# EAGLE design adafruit tlc59711 v1 (EAGLE 6.3)
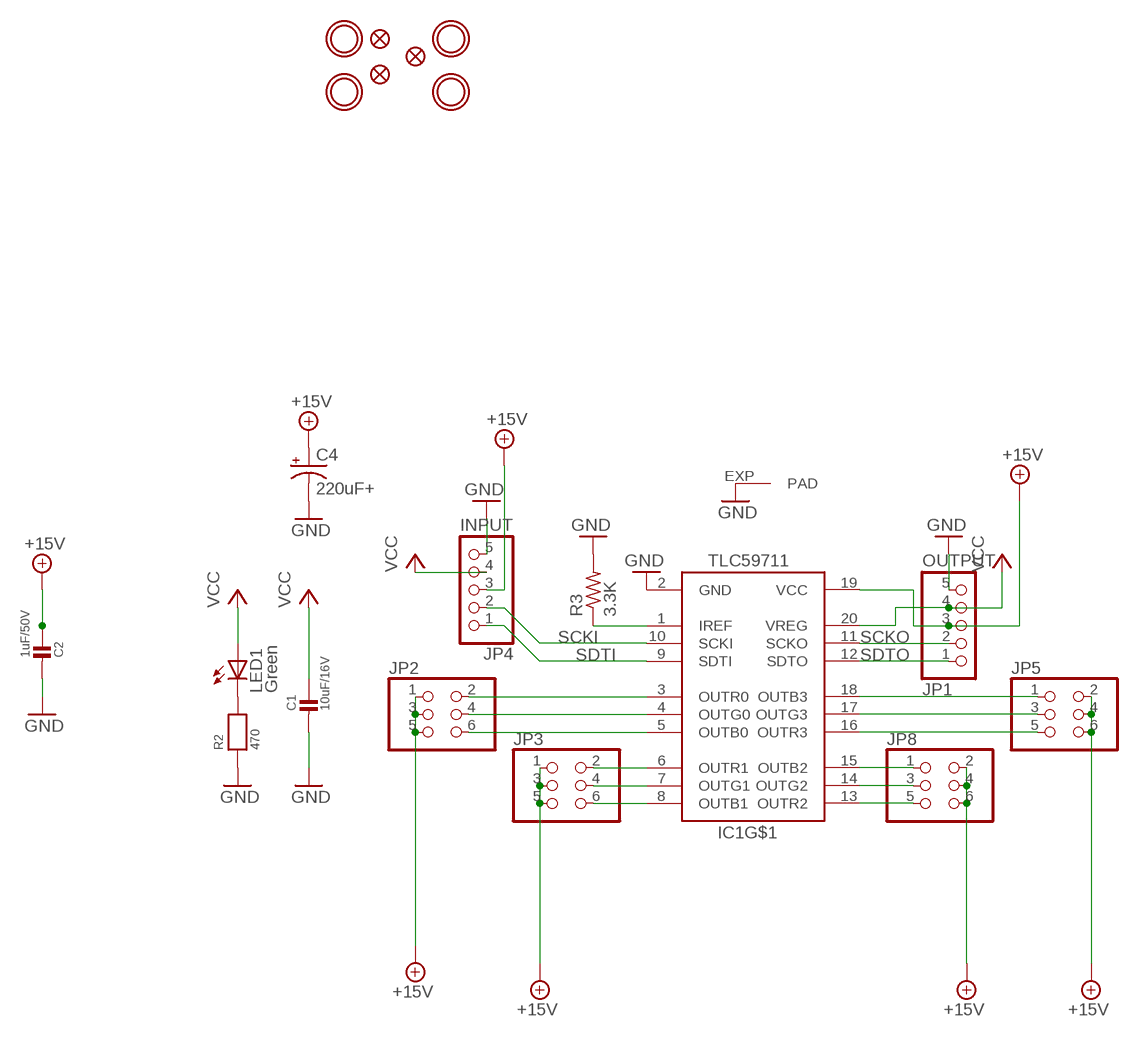
[diagram p0: schematic, sheet 1]

## Parts
C1  10uF/16V  CAP_CERAMIC0805  [0805]
C2  1uF/50V  CAP_CERAMIC0805  [0805]
C4  220uF+  CPOL-USE2.5-7  [E2,5-7]
FID1  FIDUCIAL""  [FIDUCIAL_1MM]
FID2  FIDUCIAL""  [FIDUCIAL_1MM]
FID3  FIDUCIAL""  [FIDUCIAL_1MM]
IC1  TLC59711  [HTSSOP20DAP]
JP1  OUTPUT  HEADER-1X570MIL  [1X05_ROUND_70]
JP2  HEADER-2X3  [2X03_ROUND_70MIL]
JP3  HEADER-2X3  [2X03_ROUND_70MIL]
JP4  INPUT  HEADER-1X570MIL  [1X05_ROUND_70]
JP5  HEADER-2X3  [2X03_ROUND_70MIL]
JP8  HEADER-2X3  [2X03_ROUND_70MIL]
LED1  Green  LEDCHIP-LED0805  [CHIP-LED0805]
R2  470  RESISTOR0805  [0805]
R3  3.3K  R-US_FLIPFLOP7  [0805-THM-7]
U$1  MOUNTINGHOLE2.5  [MOUNTINGHOLE_2.5_PLATED]
U$2  MOUNTINGHOLE2.5  [MOUNTINGHOLE_2.5_PLATED]
U$3  MOUNTINGHOLE2.5  [MOUNTINGHOLE_2.5_PLATED]
U$4  MOUNTINGHOLE2.5  [MOUNTINGHOLE_2.5_PLATED]

## Nets
+15V: C2.1 C4.+ IC1.19(VCC) JP1.3 JP2.1 JP2.3 JP2.5 JP3.1 JP3.3 JP3.5 JP4.3 JP5.2 JP5.4 JP5.6 JP8.2 JP8.4 JP8.6
GND: C1.2 C2.2 C4.- IC1.2(GND) IC1.EXP(PAD) JP1.5 JP4.5 R2.1 R3.2
N$1: LED1.C R2.2
N$2: IC1.1(IREF) R3.1
N$8: IC1.3(OUTR0) JP2.2
N$9: IC1.4(OUTG0) JP2.4
N$10: IC1.5(OUTB0) JP2.6
N$11: IC1.6(OUTR1) JP3.2
N$12: IC1.7(OUTG1) JP3.4
N$13: IC1.8(OUTB1) JP3.6
N$26: IC1.15(OUTB2) JP8.1
N$27: IC1.14(OUTG2) JP8.3
N$28: IC1.13(OUTR2) JP8.5
N$29: IC1.18(OUTB3) JP5.1
N$30: IC1.17(OUTG3) JP5.3
N$31: IC1.16(OUTR3) JP5.5
SCKI: IC1.10(SCKI) JP4.2
SCKO: IC1.11(SCKO) JP1.2
SDTI: IC1.9(SDTI) JP4.1
SDTO: IC1.12(SDTO) JP1.1
VCC: C1.1 IC1.20(VREG) JP1.4 JP4.4 LED1.A

## Library data of the parts
C1 C2 = microbuilder:CAP_CERAMIC: Ceramic Capacitors For new designs, use the packages preceded by an '_' character since they are more reliable: The following footprints should be used on most boards: _0402 - Standard footprint for regular board layouts _0603 - Standard footprint for regular board layouts _0805 - Standard footprint for regular board layouts For extremely tight-pitch boards where space is at a premium, the following 'micro-pitch' footprints can be used (smaller pads, no silkscreen outline, etc.): _0402MP - Micro-pitch footprint for very dense/compact boards _0603MP - Micro-pitch footprint for very dense/compact boards _0805MP - Micro-pitch footprint for very dense/compact boards Commonly Stocked Parts 0402 - 0402 Surface Mount Capacitors 16pF 50V 5% [Digikey: 445-4899-2-ND] 18pF 50V 5% [Digikey: 490-1281-2-ND] 22pF 50V 5% [Digikey: 490-1283-2-ND] 68pF 50V 5% [Digikey: 490-1289-2-ND] 0.1uF 10V 10% [Digikey: 490-1318-2-ND] 1.0uF 6.3V 10% [Digikey: 490-1320-2-ND] 0603 - 0603 Surface Mount Capacitors 16 pF 50V 5% [Digikey: 445-5051-2-ND] 22 pF 50V [Digikey: PCC220ACVTR-ND] 33 pF 50V 5% [Digikey: 490-1415-1-ND] 56pF 50V 5% [Digikey: 490-1421-1-ND] 220pF 50V 5% [Digikey: 445-1285-1-ND] 680 pF 50V 2200 pF 50V 5% C0G [Digikey: 445-1297-1-ND] 5600 pF 100V 5% X7R [Digikey: 478-3711-1-ND] 0.1 µF 25V 10% [Digikey: PCC2277TR-ND] 0.22 µF 16V 10% X7R [Digikey: 445-1318-1-ND] 1.0 µF 25V 10% [Digikey: 445-5146-2-ND] 0603 - RF Specific 3pF 250V +/-0.1pF RF [Digikey: 712-1347-1-ND] 18 pF 250V 5% [Digikey: 478-3505-1-ND or 712-1322-1-ND] 56 pF 250V 5% C0G RF [Digikey: 490-4867-1-ND] 68 pF 250V RF [Digikey: 490-4868-1-ND] 0805 - 0805 Surface Mount Capacitors 220 pF 250V 2% RF Ceramic Capacitor [Digikey: 712-1398-1-ND] 1000 pF 50V 2% NP0 Ceramic Capacitor [Digikey: 478-3760-1-ND] 0.1 µF 25V 10% Ceramic Capacitor [Digikey: PCC1828TR-ND] 1.0 µF 16V 10% Ceramic Capacitor[Digikey: 490-1691-2-ND] 10.0 µF 10V 10% Ceramic Capacitor[Digikey: 709-1228-1-ND] 10.0 uF 16V 10% Ceramic Capacitor [Digikey: 478-5165-2-ND] 47 uF 6.3V 20% Ceramic Capacitor [Digikey: 587-1779-1-ND or 399-5506-1-ND] 1206 - 1206 Surface Mount Capacitors 47uF 10V 20% Ceramic Capacitor [Digikey: 490-5528-1-ND or 399-5508-1-ND or 445-6010-1-ND] 100uF 6.3V -20%, +80% Y5V Ceramic Capacitor (Digikey: 490-4512-1-ND, Mouser: 81-GRM31CF50J107ZE1L)
C4 = adafruit:CPOL-US: POLARIZED CAPACITOR, American symbol
FID1-FID3 = microbuilder:FIDUCIAL: Fiducial Alignment Points Various fiducial points for machine vision alignment.; BOM: EXCLUDE
IC1 = adafruit:TLC59711
JP1 JP4 = microbuilder:HEADER-1X5: PIN HEADER
JP2 JP3 JP5 JP8 = microbuilder:HEADER-2X3: PIN HEADER
LED1 = adafruit:LED: LED OSRAM: - CHIPLED LG R971, LG N971, LY N971, LG Q971, LY Q971, LO R971, LY R971 LH N974, LH R974 LS Q976, LO Q976, LY Q976 LO Q996 - Hyper CHIPLED LW Q18S LB Q993, LB Q99A, LB R99A - SideLED LS A670, LO A670, LY A670, LG A670, LP A670 LB A673, LV A673, LT A673, LW A673 LH A674 LY A675 LS A676, LA A676, LO A676, LY A676, LW A676 LS A679, LY A679, LG A679 - Hyper Micro SIDELED® LS Y876, LA Y876, LO Y876, LY Y876 LT Y87S - SmartLED LW L88C, LW L88S LB L89C, LB L89S, LG L890 LS L89K, LO L89K, LY L89K LS L896, LA L896, LO L896, LY L896 - TOPLED LS T670, LO T670, LY T670, LG T670, LP T670 LSG T670, LSP T670, LSY T670, LOP T670, LYG T670 LG T671, LOG T671, LSG T671 LB T673, LV T673, LT T673, LW T673 LH T674 LS T676, LA T676, LO T676, LY T676, LB T676, LH T676, LSB T676, LW T676 LB T67C, LV T67C, LT T67C, LS T67K, LO T67K, LY T67K, LW E67C LS E67B, LA E67B, LO E67B, LY E67B, LB E67C, LV E67C, LT E67C LW T67C LS T679, LY T679, LG T679 LS T770, LO T770, LY T770, LG T770, LP T770 LB T773, LV T773, LT T773, LW T773 LH T774 LS E675, LA E675, LY E675, LS T675 LS T776, LA T776, LO T776, LY T776, LB T776 LHGB T686 LT T68C, LB T68C - Hyper Mini TOPLED® LB M676 - Mini TOPLED Santana® LG M470 LS M47K, LO M47K, LY M47K Source: http://www.osram.convergy.de/
R2 = microbuilder:RESISTOR: Resistors For new designs, use the packages preceded by an '_' character since they are more reliable: The following footprints should be used on most boards: _0402 - Standard footprint for regular board layouts _0603 - Standard footprint for regular board layouts _0805 - Standard footprint for regular board layouts For extremely tight-pitch boards where space is at a premium, the following 'micro-pitch' footprints can be used (smaller pads, no silkscreen outline, etc.): _0402MP - Micro-pitch footprint for very dense/compact boards _0603MP - Micro-pitch footprint for very dense/compact boards _0805MP - Micro-pitch footprint for very dense/compact boards
R3 = adafruit:R-US_: RESISTOR, American symbol
U$1-U$4 = microbuilder:MOUNTINGHOLE: Mounting Hole For #2 screws (0.086"/2.18mm width, 0.094"/2.4mm hole) use 2.5mm

## Board
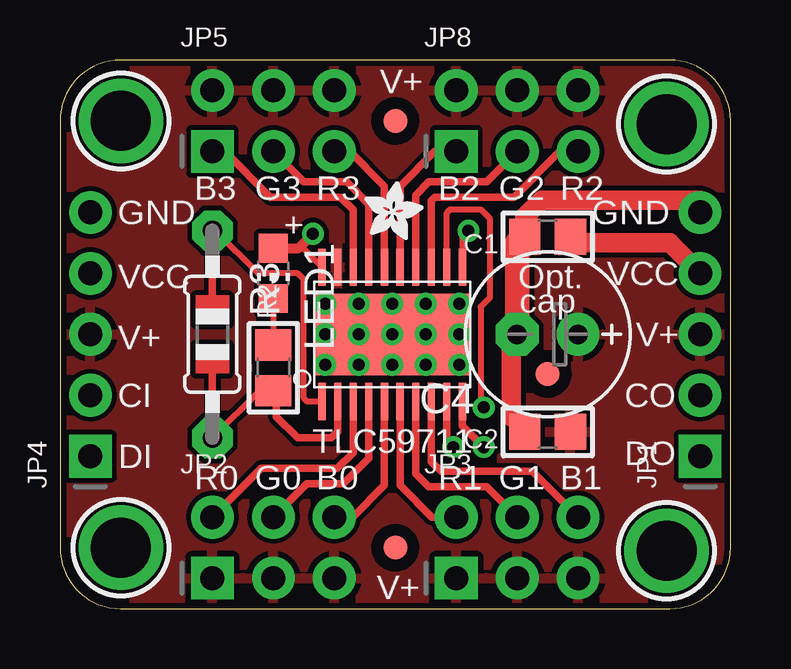
[diagram p1: board, top side]
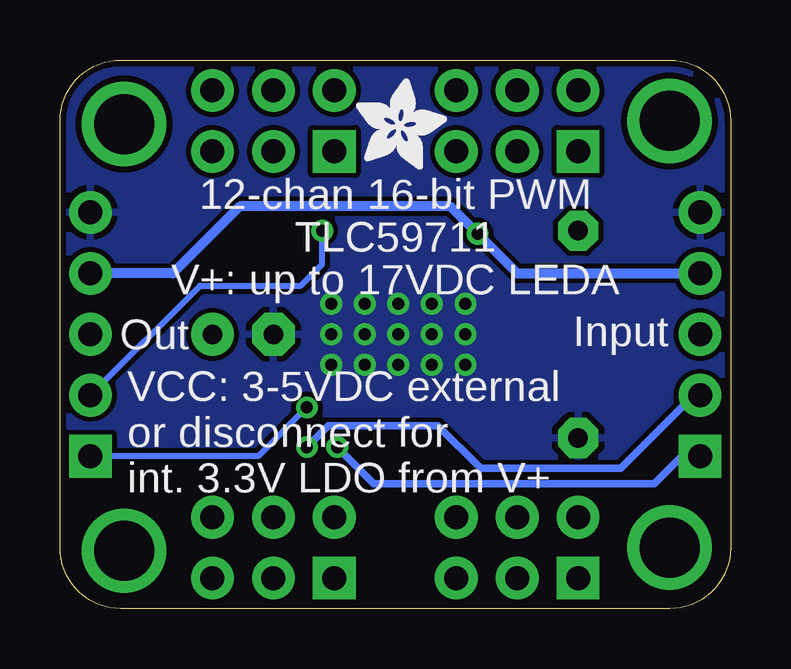
[diagram p2: board, bottom side, seen from below]

Size 27.94 x 22.86 mm. Coordinates in mm from the lower left corner, seen from the top.
Outline: 0,20.32 0,2.54 arc90 2.54,0 25.4,0 arc90 27.94,2.54 27.94,20.32 arc90 25.4,22.86 2.54,22.86 arc90 0,20.32
Copper layers (1*16): Top 0.035mm / dielectric 1.5mm / Bottom 0.035mm
Design rules "adafruit *": minimum track width 8mil, minimum drill 15.5mil, track to track 8mil, track to pad 8mil, pad to pad 8mil, via to via 8mil, smd to smd 8mil, copper to edge 10mil, drill to drill 8mil, minimum pad ring 10mil, minimum via ring 8mil, stop-mask expansion 4mil, vias tented up to drill 20mil, thermal gap 10mil

### Footprints (pad centres in the part's own frame; a part is rotated, then mirrored left to right if it is on the bottom)
0805 = smd 1.3 x 1.5: 1 -0.95,0; 2 0.95,0
E2,5-7 = drill 0.813 pad 1.778: + -1.27,0 | drill 0.813 pad 1.778 octagon: - 1.27,0
FIDUCIAL_1MM = smd 1 x 1: 1 0,0
HTSSOP20DAP = smd 0.3 x 1.55: 1 -2.925,-2.8; 2 -2.275,-2.8; 3 -1.625,-2.8; 4 -0.975,-2.8; 5 -0.325,-2.8; 6 0.325,-2.8; 7 0.975,-2.8; 8 1.625,-2.8; 9 2.275,-2.8; 10 2.925,-2.8; 11 2.925,2.8; 12 2.275,2.8; 13 1.625,2.8; 14 0.975,2.8; 15 0.325,2.8; 16 -0.325,2.8; 17 -0.975,2.8; 18 -1.625,2.8; 19 -2.275,2.8; 20 -2.925,2.8 | smd 6.5 x 3.4: EXP 0,0
1X05_ROUND_70 = drill 1 pad 1.778 square: 1 -5.08,0 | drill 1 pad 1.778: 2 -2.54,0; 3 0,0; 4 2.54,0; 5 5.08,0
2X03_ROUND_70MIL = drill 1 pad 1.778 square: 1 -2.54,-1.27 | drill 1 pad 1.778: 2 -2.54,1.27; 3 0,-1.27; 4 0,1.27; 5 2.54,-1.27; 6 2.54,1.27
CHIP-LED0805 = smd 1.2 x 1.2: A 0,-1.05; C 0,1.05
0805-THM-7 = drill 0.813 pad 1.676 octagon: 1 -4.318,0; 2 4.318,0
MOUNTINGHOLE_2.5_PLATED = drill 2.5 pad 3.2: P$1 0,0

### Placement (x,y rotation side)
C1  20.32,15.49 180 top
C2  20.32,7.37 180 top
C4  20.32,11.43 180 top
FID1  13.97,2.54 0 top
FID2  20.32,9.78 0 top
FID3  13.97,20.32 0 top
IC1  13.84,11.43 0 top
JP1  26.67,11.43 90 top
JP2  8.89,2.54 0 top
JP3  19.05,2.54 0 top
JP4  1.27,11.43 90 top
JP5  8.89,20.32 0 top
JP8  19.05,20.32 0 top
LED1  8.89,13.97 180 top
R2  8.89,10.03 90 top
R3  6.35,11.43 270 top
U$1  2.54,20.32 0 top
U$2  25.27,20.19 0 top
U$3  2.54,2.54 0 top
U$4  25.27,2.41 0 top
U$7  [ADAFRUIT_2.5MM]  12.7,15.37 0 top
U$8  [ADAFRUIT_3.5MM]  15.62,18.29 0 bottom

### Tracks (layer width: path | path; a pad name or v marks a point on that pad's centre or on a via)
+15V
  pour Top: 27.81,-0.13 0,0 0,22.86 27.81,22.73
GND  (via drill 0.5)
  Top 0.254: R2.1 8.32,9.08 R3.2
  Top 0.305: IC1.2 11.57,7.38 11.3,7.11 9.91,7.11 9.02,8 9.02,8.96 R2.1
  Top 0.61: 19.05,15.24 19.37,15.24 C1.2 | 18.8,8 19.37,7.43 C2.2
  Top 0.813: 18.8,8 18.8,11.18 C4.- | JP1.5 26.67,17.02 20.07,17.02 19.37,16.32 C1.2
  Top 1.016: 19.05,15.24 C4.-
  other vias: 11.05,12.7 11.05,11.43 11.05,10.16 12.45,10.16 12.45,11.43 12.45,12.7 13.84,12.7 13.84,11.43 13.84,10.16 15.24,10.16 15.24,11.43 15.24,12.7 16.64,12.7 16.64,11.43 16.64,10.16
  pour Bottom: 27.81,-0.13 27.81,22.73 0,22.86 0,0
N$1
  Top 0.254: LED1.C R2.2
N$2
  Top 0.254: IC1.1 10.29,8.63 10.16,8.76 10.16,13.72 9.91,13.97 8.26,13.97 6.48,15.75 R3.1
N$8
  Top 0.305: IC1.3 12.22,6.5 11.56,5.84 8.38,5.84 JP2.2
N$9
  Top 0.305: IC1.4 12.87,6.26 11.81,5.21 10.29,5.21 JP2.4
N$10
  Top 0.305: IC1.5 13.52,5.14 12.19,3.81 11.56,3.81 JP2.6
N$11
  Top 0.305: IC1.6 14.17,5.14 15.49,3.81 JP3.2
N$12
  Top 0.305: IC1.7 14.82,5.63 15.37,5.08 17.78,5.08 JP3.4
N$13
  Top 0.305: IC1.8 15.47,6.12 15.88,5.71 19.68,5.71 JP3.6
N$26
  Top 0.305: IC1.15 14.17,17.6 15.62,19.05 JP8.1
N$27
  Top 0.305: IC1.14 14.82,17.23 15.37,17.78 17.78,17.78 JP8.3
N$28
  Top 0.305: IC1.13 15.47,16.99 15.62,17.14 18.92,17.14 20.83,19.05 JP8.5
N$29
  Top 0.305: IC1.18 12.22,16.61 11.68,17.14 8.76,17.14 6.86,19.05 JP5.1
N$30
  Top 0.305: IC1.17 12.87,16.85 11.94,17.78 10.16,17.78 JP5.3
N$31
  Top 0.305: IC1.16 13.52,17.6 12.06,19.05 JP5.5
SCKI  (via drill 0.5)
  Top 0.305: IC1.10 16.77,7.62 v17.65,6.73
  Bottom 0.305: v17.65,6.73 16.76,7.62 12.19,7.62 10.41,5.84 4.57,5.84 1.52,8.89 JP4.2
SCKO  (via drill 0.5)
  Top 0.254: v17.02,15.75 16.77,15.5 IC1.11
  Bottom 0.254: JP1.2 22.1,13.46 17.91,13.46 17.02,14.35 v17.02,15.75
SDTI  (via drill 0.5)
  Top 0.305: IC1.9 16.12,7 v16.38,6.73
  Bottom 0.305: v16.38,6.73 14.86,5.21 3.17,5.21 2.03,6.35 JP4.1
SDTO  (via drill 0.5)
  Top 0.254: IC1.12 16.12,16.5 16.26,16.64 17.53,16.64 17.91,16.26 17.91,12.95 17.53,12.57 17.53,8.51 v17.65,8.38
  Bottom 0.254: v17.65,8.38 19.68,6.35 JP1.1
VCC  (via drill 0.5)
  Top 0.254: IC1.20 10.13,15.02 LED1.A
  Top 0.406: 8.86,15.02 LED1.A 9.94,15.02 v10.54,15.62
  Top 0.61: 21.46,15.24 21.27,15.24 C1.1
  Top 0.813: 21.46,15.24 25.4,15.24 JP1.4
  Bottom 0.406: JP4.4 8.89,13.97 v10.54,15.62 11.68,16.76 20.45,16.76 23.24,13.97 JP1.4

### Text on the board
tPlace: V+ | B3 | G3 | R3 | B2 | G2 | R2 | GND | GND | Opt. | VCC | VCC | cap | V+ | V+ | CO | CI | TLC59711 | DO | DI | R0 | G0 | B0 | R1 | G1 | B1 | V+
bPlace: 12-chan 16-bit PWM | TLC59711 | V+: up to 17VDC LEDA | Input | Out | VCC: 3-5VDC external / or disconnect for / int. 3.3V LDO from V+